# EAGLE schematic schematics (EAGLE 6.2)
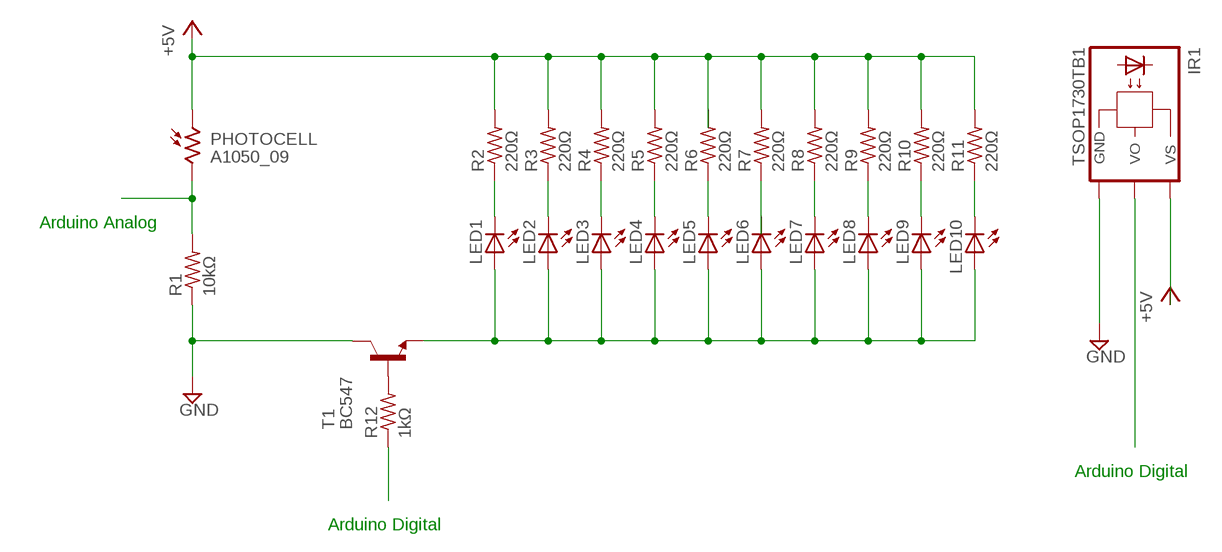
[diagram p0: schematic, sheet 1]

## Parts
IR1  TSOP1730TB1  [TSOP17_TB1]
LED1  LED5MM  [LED5MM]
LED2  LED5MM  [LED5MM]
LED3  LED5MM  [LED5MM]
LED4  LED5MM  [LED5MM]
LED5  LED5MM  [LED5MM]
LED6  LED5MM  [LED5MM]
LED7  LED5MM  [LED5MM]
LED8  LED5MM  [LED5MM]
LED9  LED5MM  [LED5MM]
LED10  LED5MM  [LED5MM]
PHOTOCELL  A1050_09  [T0-46-A10XX]
R1  10kΩ  R-US_0204/5  [0204/5]
R2  220Ω  R-US_0204/5  [0204/5]
R3  220Ω  R-US_0204/5  [0204/5]
R4  220Ω  R-US_0204/5  [0204/5]
R5  220Ω  R-US_0204/5  [0204/5]
R6  220Ω  R-US_0204/5  [0204/5]
R7  220Ω  R-US_0204/5  [0204/5]
R8  220Ω  R-US_0204/5  [0204/5]
R9  220Ω  R-US_0204/5  [0204/5]
R10  220Ω  R-US_0204/5  [0204/5]
R11  220Ω  R-US_0204/5  [0204/5]
R12  1kΩ  R-US_0204/5  [0204/5]
T1  BC547  [TO92]

## Nets
2: IR1.VO
6: R12.1
+5V: IR1.VS PHOTOCELL.1 R2.2 R3.2 R4.2 R5.2 R7.2 R8.2 R9.2 R10.2 R11.2
A0: PHOTOCELL.2 R1.2
GND: IR1.GND R1.1 T1.3(C)
LED-: LED1.A LED2.A LED3.A LED4.A LED5.A LED6.A LED7.A LED8.A LED9.A LED10.A T1.1(E)
N$2: LED1.K(C) R2.1
N$3: LED2.K(C) R3.1
N$4: LED3.K(C) R4.1
N$5: LED4.K(C) R5.1
N$6: LED5.K(C) R6.1
N$7: R7.1
N$8: LED7.K(C) R8.1
N$9: LED8.K(C) R9.1
N$10: LED9.K(C) R10.1
N$11: LED10.K(C) R11.1
N$13: R12.2 T1.2(B)
Unconnected: LED6.K(C) R6.2

## Notes on the sheet
- Arduino Analog
- Arduino Digital
- Arduino Digital

## Library data of the parts
IR1 = telefunken:TSOP17*TB1: TSOP17..TB1 IR Receiver Modules for Remote Control Systems Source: http://www.vishay.com/docs/82042/82042.pdf; OC_FARNELL: unknown; OC_NEWARK: unknown
LED1-LED10 = led:LED: LED OSRAM: - CHIPLED LG R971, LG N971, LY N971, LG Q971, LY Q971, LO R971, LY R971 LH N974, LH R974 LS Q976, LO Q976, LY Q976 LO Q996 - Hyper CHIPLED LW Q18S LB Q993, LB Q99A, LB R99A - SideLED LS A670, LO A670, LY A670, LG A670, LP A670 LB A673, LV A673, LT A673, LW A673 LH A674 LY A675 LS A676, LA A676, LO A676, LY A676, LW A676 LS A679, LY A679, LG A679 - Hyper Micro SIDELED® LS Y876, LA Y876, LO Y876, LY Y876 LT Y87S - SmartLED LW L88C, LW L88S LB L89C, LB L89S, LG L890 LS L89K, LO L89K, LY L89K LS L896, LA L896, LO L896, LY L896 - TOPLED LS T670, LO T670, LY T670, LG T670, LP T670 LSG T670, LSP T670, LSY T670, LOP T670, LYG T670 LG T671, LOG T671, LSG T671 LB T673, LV T673, LT T673, LW T673 LH T674 LS T676, LA T676, LO T676, LY T676, LB T676, LH T676, LSB T676, LW T676 LB T67C, LV T67C, LT T67C, LS T67K, LO T67K, LY T67K, LW E67C LS E67B, LA E67B, LO E67B, LY E67B, LB E67C, LV E67C, LT E67C LW T67C LS T679, LY T679, LG T679 LS T770, LO T770, LY T770, LG T770, LP T770 LB T773, LV T773, LT T773, LW T773 LH T774 LS E675, LA E675, LY E675, LS T675 LS T776, LA T776, LO T776, LY T776, LB T776 LHGB T686 LT T68C, LB T68C - Hyper Mini TOPLED® LB M676 - Mini TOPLED Santana® LG M470 LS M47K, LO M47K, LY M47K Source: http://www.osram.convergy.de LUXEON: - LUMILED® LXK2-PW12-R00, LXK2-PW12-S00, LXK2-PW14-U00, LXK2-PW14-V00 LXK2-PM12-R00, LXK2-PM12-S00, LXK2-PM14-U00 LXK2-PE12-Q00, LXK2-PE12-R00, LXK2-PE12-S00, LXK2-PE14-T00, LXK2-PE14-U00 LXK2-PB12-K00, LXK2-PB12-L00, LXK2-PB12-M00, LXK2-PB14-N00, LXK2-PB14-P00, LXK2-PB14-Q00 LXK2-PR12-L00, LXK2-PR12-M00, LXK2-PR14-Q00, LXK2-PR14-R00 LXK2-PD12-Q00, LXK2-PD12-R00, LXK2-PD12-S00 LXK2-PH12-R00, LXK2-PH12-S00 LXK2-PL12-P00, LXK2-PL12-Q00, LXK2-PL12-R00 Source: www.luxeon.com KINGBRIGHT: KA-3528ASYC Source: www.kingbright.com
PHOTOCELL = photo-elements:A10: Sensor Robust Light Sensing Applications Outdoor Light Sensing Application Source: http://optoelectronics.perkinelmer.com/content/Datasheets/DTS_PhotocellsA1050.pdf
R1-R12 = rcl:R-US_: RESISTOR, American symbol
T1 = transistor:BC547: NPN TRANSISTOR